# Altium project Team_Deamos_PCB_Simplified.PrjPcb
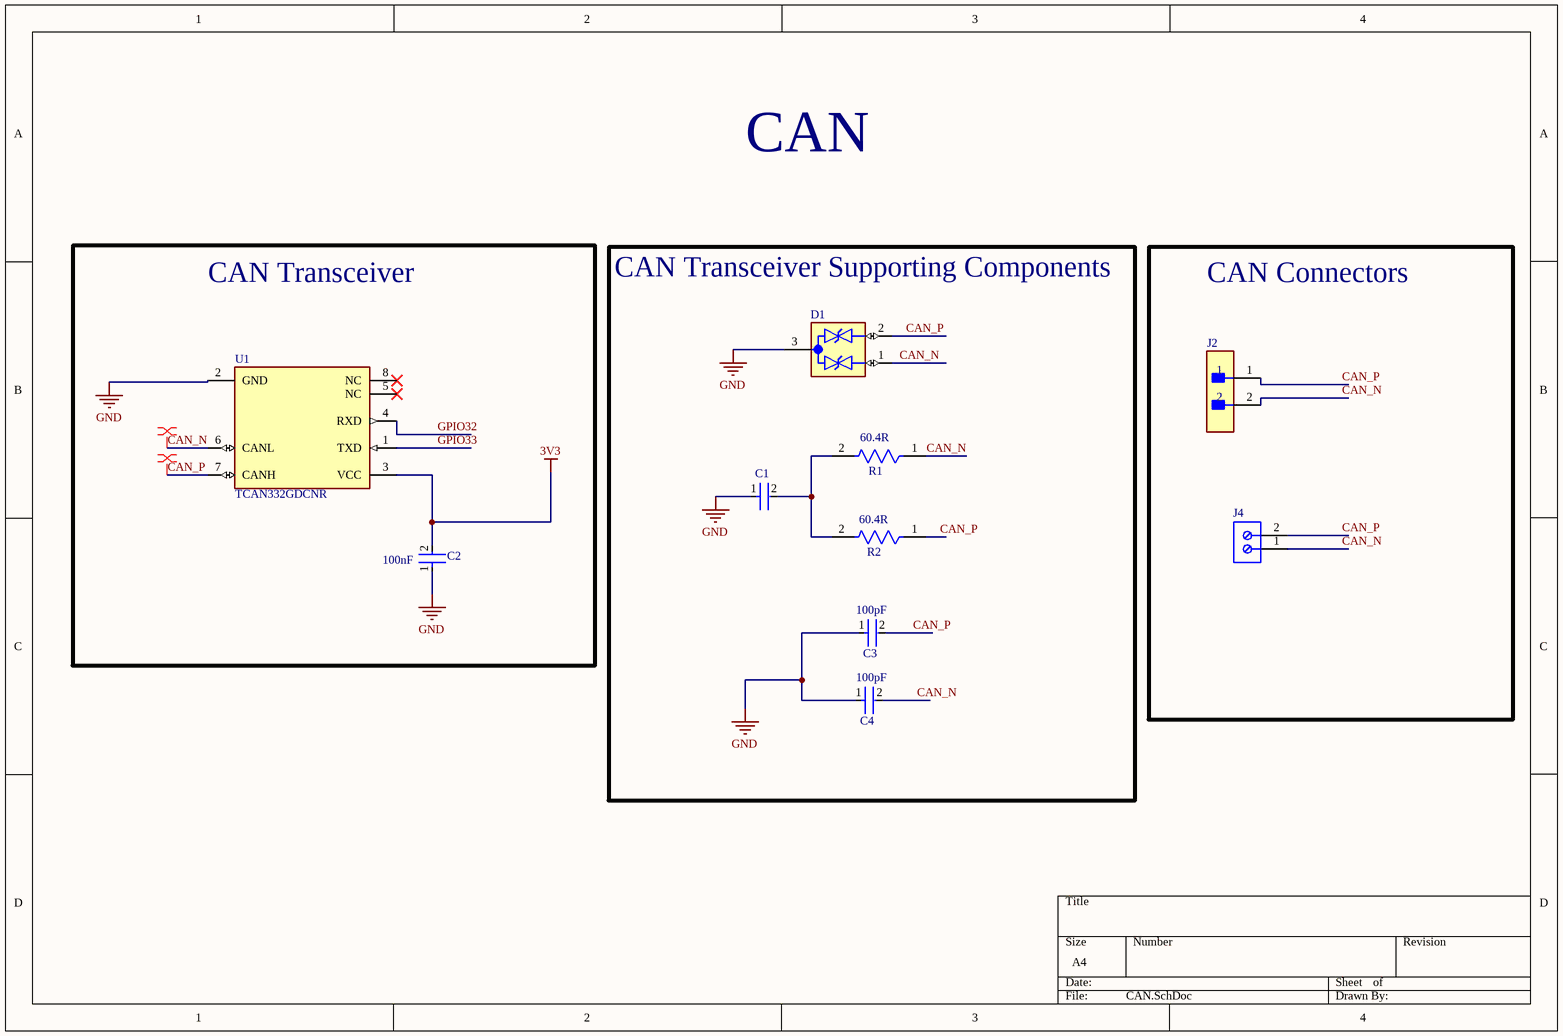
[diagram p0: CAN.SchDoc]
1 sheet, 10 parts. Net scope: global (net labels, ports and power ports of the same name join across sheets).
Board file: PCB1.PcbDoc

## Sheet CAN.SchDoc
size A4; SheetNumber: 2; SheetTotal: 2

### Parts
C1  CC0402KRX7R6BB472  [FP-CC0402-MFG]  (value not drawn)
C2  Capacitance: 100nF  [FP-CL17-IPC_C]  (hidden comment: CL05B104KP5NNNC)
C3  value 100pF  [FP-CL05-MFG]  (hidden comment: CL05C101JB5NNNC)
C4  value 100pF  [FP-CL05-MFG]  (hidden comment: CL05C101JB5NNNC)
D1  ESD2CAN24DBZRQ1  [SOT95P237X112-3N]  (value not drawn)
J2  M20-9990246  [FP-M20-9990246-MFG]  (value not drawn)
J4  691137710002  [691137710002]  (value not drawn)
R1  Resistance: 60.4R  [FP-ERJ2RK-IPC_A]  (hidden comment: ERJ-2RKF60R4X)
R2  Resistance: 60.4R  [FP-ERJ2RK-IPC_A]  (hidden comment: ERJ-2RKF60R4X)
U1  TCAN332GDCNR  [FP-DCN0008A-IPC_A]

### Blocks framed on the sheet
CAN Transceiver: C2 U1
CAN Transceiver Supporting Components: C1 C3 C4 D1 R1 R2
CAN Connectors: J2 J4

### Nets
3V3: C2.2 U1.3(VCC)
GND: C1.1 C2.1 C3.1 C4.1 D1.3(GND) U1.2(GND)
CAN_N: C4.2 D1.1(IO1) J2.2 J4.1 R1.1 U1.6(CANL)
CAN_P: C3.2 D1.2(IO2) J2.1 J4.2 R2.1 U1.7(CANH)
GPIO32: U1.4(RXD)
GPIO33: U1.1(TXD)
NetC1_2: C1.2 R1.2 R2.2

Not connected (* = marked no-connect by the designer): U1 5(NC)* 8(NC)*

### Layout directives
differential pair; differential pair class CAN: CAN_N, CAN_P

### Notes on the sheet
- CAN

### Library data of the parts
C1 = CMP-03422-001343-1: CC0402 4.7 nF X7R 10.00% 10 V; Manufacturer: YAGEO; Tolerance: 0.1; Material: Ceramic; Temperature Coefficient: 30ppm/°C; Value: 4.7 nF; Automotive Grade: NA; Voltage Rating: 10 V; Device Class L3: Ceramic Capacitors; RoHS: TRUE; Manufacturer Part Number: CC0402KRX7R6BB472; Temperature Range High: +125°C; Device Class L1: Passive Components; Capacitance: 4.7 nF; Device Class L2: Capacitors; Temperature Characteristic: X7R; Mouser Description: Cap Ceramic 0.0047uF 10V X7R 10% SMD 0402 125°C Paper T/R; Lead Free: Yes; ComponentLink2Description: Datasheet; Footprint Url: http://www.yageo.com/exep/pages/download/literatures/UPY-C_GEN_24.pdf; Category: Cap; ComponentLink2URL: http://www.yageo.com/documents/recent/UPY-GP_NP0_16V-to-50V_16.pdf; Ipc Land Pattern Name: CAPC10050X50; Automotive: No; Package: CC0402; Octopart: https://octopart.com/cc0402krx7r6bb472-yageo-90326733; Temperature: -55°C to +125°C; Height: 0.55mm; Temperature Range Low: -55°C
C2 = CMP-13271-001069-1: Cap Ceramic 100nF 10V X7R ±10% SMD 0402 +125°C Paper T/R; Height: 0.5mm; Case/Package: 0402; Contact Plating: Tin; Case Code (Imperial): 0402; Thickness: 0.022inch; Min Operating Temperature: -55°C; Package Quantity: 1; Length: 1mm; Max Operating Temperature: 125°C; Depth: 0.5mm; Voltage Rating: 10V; Packaging: Tape and Reel; Mount: Surface Mount; Tolerance: 10%; Width: 0.02inch; Radiation Hardening: No; Case Code (Metric): 1005; Dielectric: X7R
C3 C4 = CMP-13271-000010-1: CAP CER 100PF 50V C0G/NP0 0402; Manufacturer: Samsung; Tolerance: 5%; Temperature Characteristic: C0G; Material: Ceramic; Temperature Coefficient: 30ppm/°C; Capacitance: 100pF; Package: CL05; Device Class L1: Passive Components; Automotive: No; Ipc Land Pattern Name: CAPC10050X50; ComponentLink2URL: http://www.samsungsem.com/global/front/downloadcms.do?path=%2F%2Fglobal%2F%2Fsupport%2F%2Fproduct-search%2F%2Fmlcc%2F%2F__icsFiles%2F%2Fafieldfile%2F%2F2019%2F%2F06%2F%2F18&fileName=CL05C101JB5NNNC-19.pdf; Temperature: -55°C to +125°C; Device Class L2: Capacitors; Digikey Description: CAP CER 100PF 50V C0G/NP0 0402; Octopart: https://octopart.com/cl05c101jb5nnnc-samsung-9299367; Manufacturer Part Number: CL05C101JB5NNNC; Temperature Range High: +125°C; Temperature Range Low: -55°C; Lead Free: Yes; ComponentLink2Description: Datasheet; RoHS: TRUE; Device Class L3: Ceramic Capacitors; Height: 0.55mm; Voltage Rating: 50V; Category: Cap
D1 = ESD2CAN24DBZRQ1: Automotive, dual, 3-pF, ±24-V, ±30-kV ESD protection diode for CAN and in-vehicle networks 3-SOT-23 -55 to 150; Manufacturer: Texas Instruments; Supplier: Digikey; Supplier Part Number: 296-ESD2CAN24DBZRQ1CT-ND; Manufacturer Part Number: ESD2CAN24DBZRQ1; RoHS: No; Category: Integrated Circuits (ICs); Stock: 12405; Pricing: 1=0.22, 10=0.149, 25=0.1316, 100=0.1125, 250=0.10328, 500=0.09774, 1000=0.09319 (USD)
J2 = CMP-15831-000009-1: CONN HEADER VERT 2POS 2.54MM; Manufacturer: Harwin; Conn Gender: Male; Conn Orientation: Vertical; Number Of Contacts: 2; Current Rating: 3A; ComponentLink2URL: https://cdn.harwin.com/pdfs/M20-999.pdf; ComponentLink2Description: Datasheet; Package: M20-9990246; Temperature: -40°C to +105°C; Octopart: https://octopart.com/m20-9990246-harwin-2590635; Mouser Description: 2.54mm (0.1") Pitch SIL Vertical PC Tail Pin Header, 6.1mm mating pin height, tin, 2 contacts; Temperature Range High: +105°C; Device Class L1: Connectors; RoHS: TRUE; Automotive: No; Height: 8.99mm; Number Of Rows: 1; Contact Material: Tin,Nickel; Category: Conn; Pitch: 2.54mm; Lead Free: Yes; Digikey Description: CONN HEADER VERT 2POS 2.54MM; Manufacturer Part Number: M20-9990246; Temperature Range Low: -40°C; Device Class L3: unset; Device Class L2: Headers and Wire Housings
J4 = CMP-1502-03324-2: NexarPartId: 78871135; Voltage Rating: 300V; Number of Contacts: 2; Current Rating: 16A; Lead Pitch: 5mm; Height: 11.6mm; Packaging: Box; RoHS: Non-Compliant; Contact Material: Nickel, Tin; Max Operating Temperature: 120°C; Number of Pins: 2; Min Operating Temperature: -30°C; Number of Rows: 1
R1 R2 = CMP-2002-01013-2: RES SMD 60.4 OHM 1% 1/10W 0402; Voltage Rating (DC): 50V; Temperature Coefficient: 100ppm/°C; Max Power Dissipation: 100mW; Height: 0.016inch; Series: ERJ; Min Operating Temperature: -55°C; Package Quantity: 1; Case/Package: 0402; Resistance Tolerance: 1%; Termination: SMD/SMT; Case Code (Imperial): 0402; Contact Plating: Tin; Resistor Type: Thick Film; Voltage Rating: 50V; Depth: 0.5mm; Features: Automotive AEC-Q200; Power Rating: 100mW; Tolerance: 1%; Max Operating Temperature: 155°C; Mount: Surface Mount; Lead Free: Contains Lead; Military Standard: Not; Case Code (Metric): 1005; Construction: Rectangular; Number of Terminations: 2; RoHS Compliant: Yes; REACH SVHC: No SVHC; Packaging: Tape and Reel; Width: 0.02inch; Length: 1mm
U1 = CMP-04872-000119-1: IC TRANSCEIVER 1/1 SOT23-8; Receiver Hysteresis: 120mV; Data Rate: 5Mbps; Case/Package: SOT-23-8; Mount: Surface Mount; Lead Free: Lead Free; Min Operating Temperature: -40°C; Max Operating Temperature: 125°C; Packaging: Tape and Reel; RoHS Compliant: Yes